# EasyEDA schematic G1000_Encoder_Base.json
TITLE: Sheet_1; REV: 1.0; Date: 2024-03-31; Sheet: 1/1; Drawn By: gagagu1; Company: Your Company
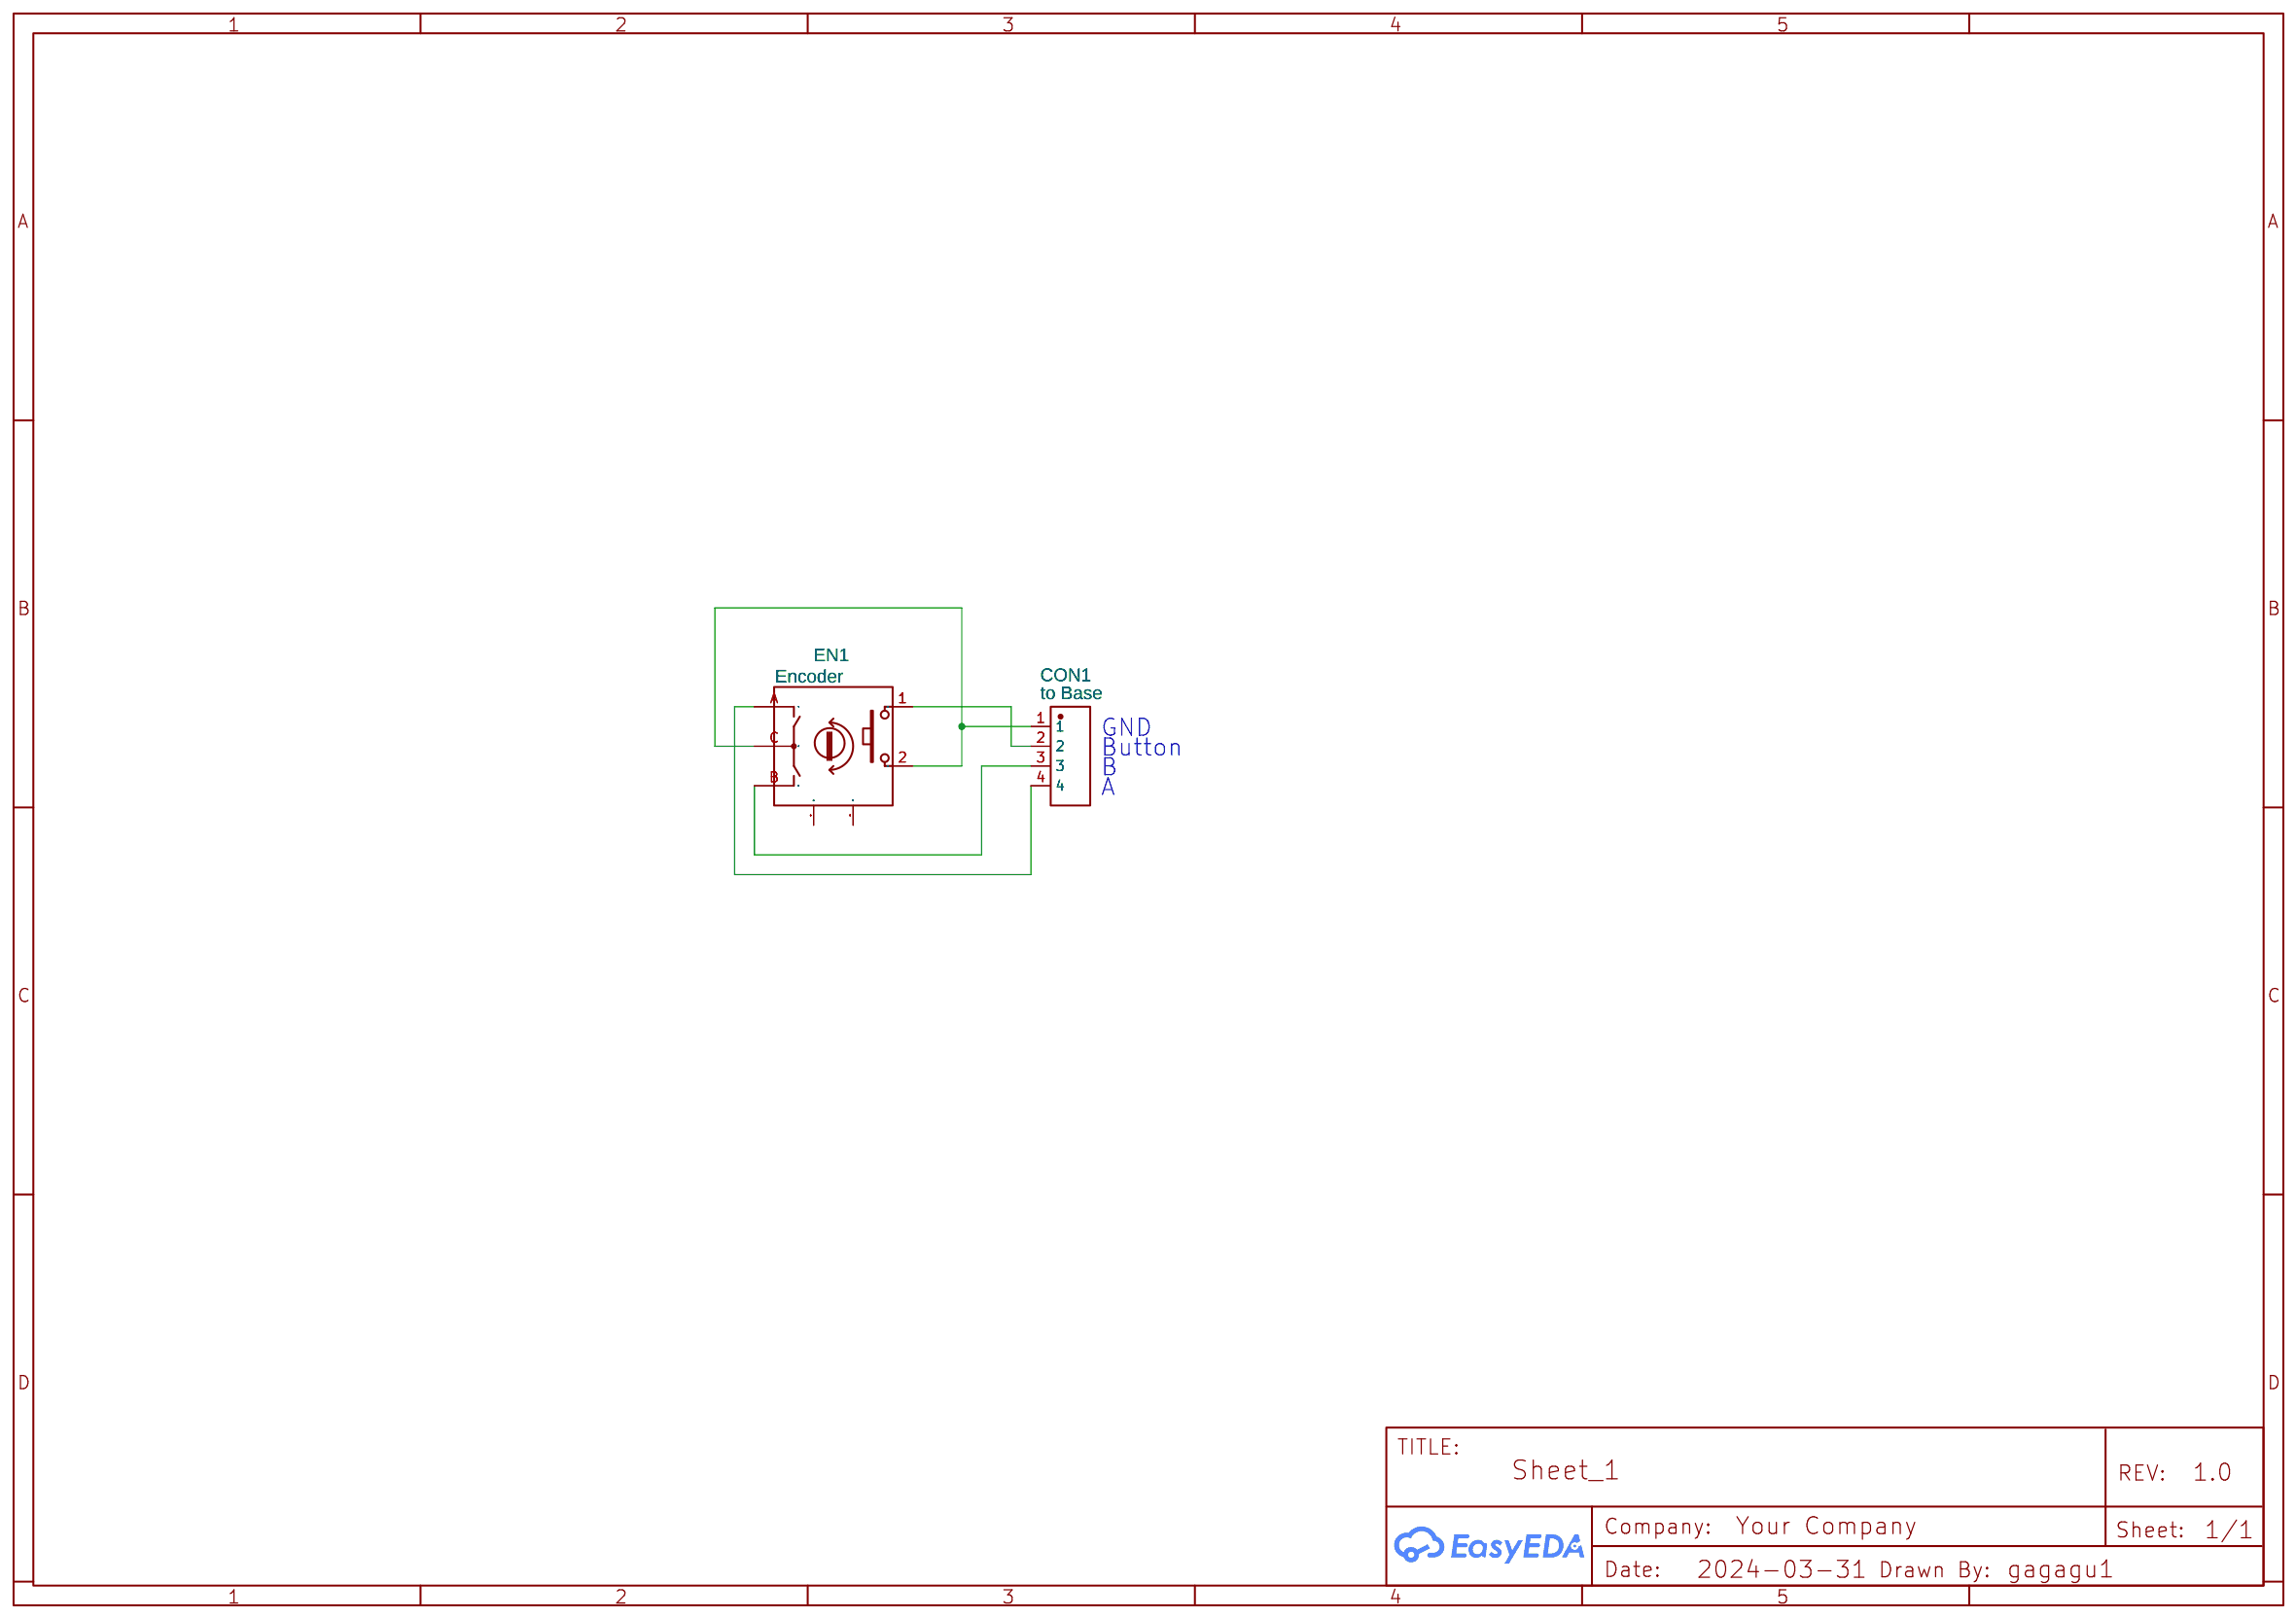
[diagram p0: schematic sheet]

## Parts
CON1  to Base  [ARUN-CONN-TH_XH-4A-1]
EN1  Encoder  [BOURNS_PEC11R-4XXXF-SXXXX]

## Library data of the parts
CON1 = ARUN-CONN-TH_XH-4A: Supplier: LCSC; Supplier Part: C192885; Manufacturer: BOOMELE(博穆精密); Manufacturer Part: XH-4A绿色; JLCPCB Part Class: Extended Part; Contributor: LCSC
EN1 = PEC11R-4015F-S0024: Supplier: LCSC; Supplier Part: C143789; Manufacturer: BOURNS; Contributor: Yarik_UA

## Nets
Net-(CON1-1): CON1.1 EN1.2 EN1.C
Net-(CON1-2): CON1.2 EN1.1
Net-(CON1-3): CON1.3 EN1.B
Net-(CON1-4): CON1.4 EN1.A

Not connected (* = marked no-connect by the designer): EN1 MT1 MT2

## Notes on the sheet
- GND
- Button
- B
- A
